# Altium schematic sheet SC941C_STORRM1.SchDoc: Sorties TOR Relais Monostable 1/2
size 393 x 270 mm; CompanyName: Seccom; Address1: 521, rue du capt. François Garbit; Address2: 69440 Mornant; Address3: seccom@seccom.fr; Address4: www.seccom.fr; DocumentNumber: 5; SheetNumber: 5; SheetTotal: 9; PageSetup: Record=PageOptions|CenterHorizontal=True|CenterVertical=True|PrintScale=0.74|XCorrection=1.00|YCorrection=1.00|PrintKind=0|BorderSize=5000000|LeftOffset=0|BottomOffset=0|Orientation=2|PaperLength=1000|PaperWidth=1000|Scale=100|PaperSource=7|PrintQuality=-4|MediaType=1|DitherType=10|PaperKind=A4|PrintScaleMode=1
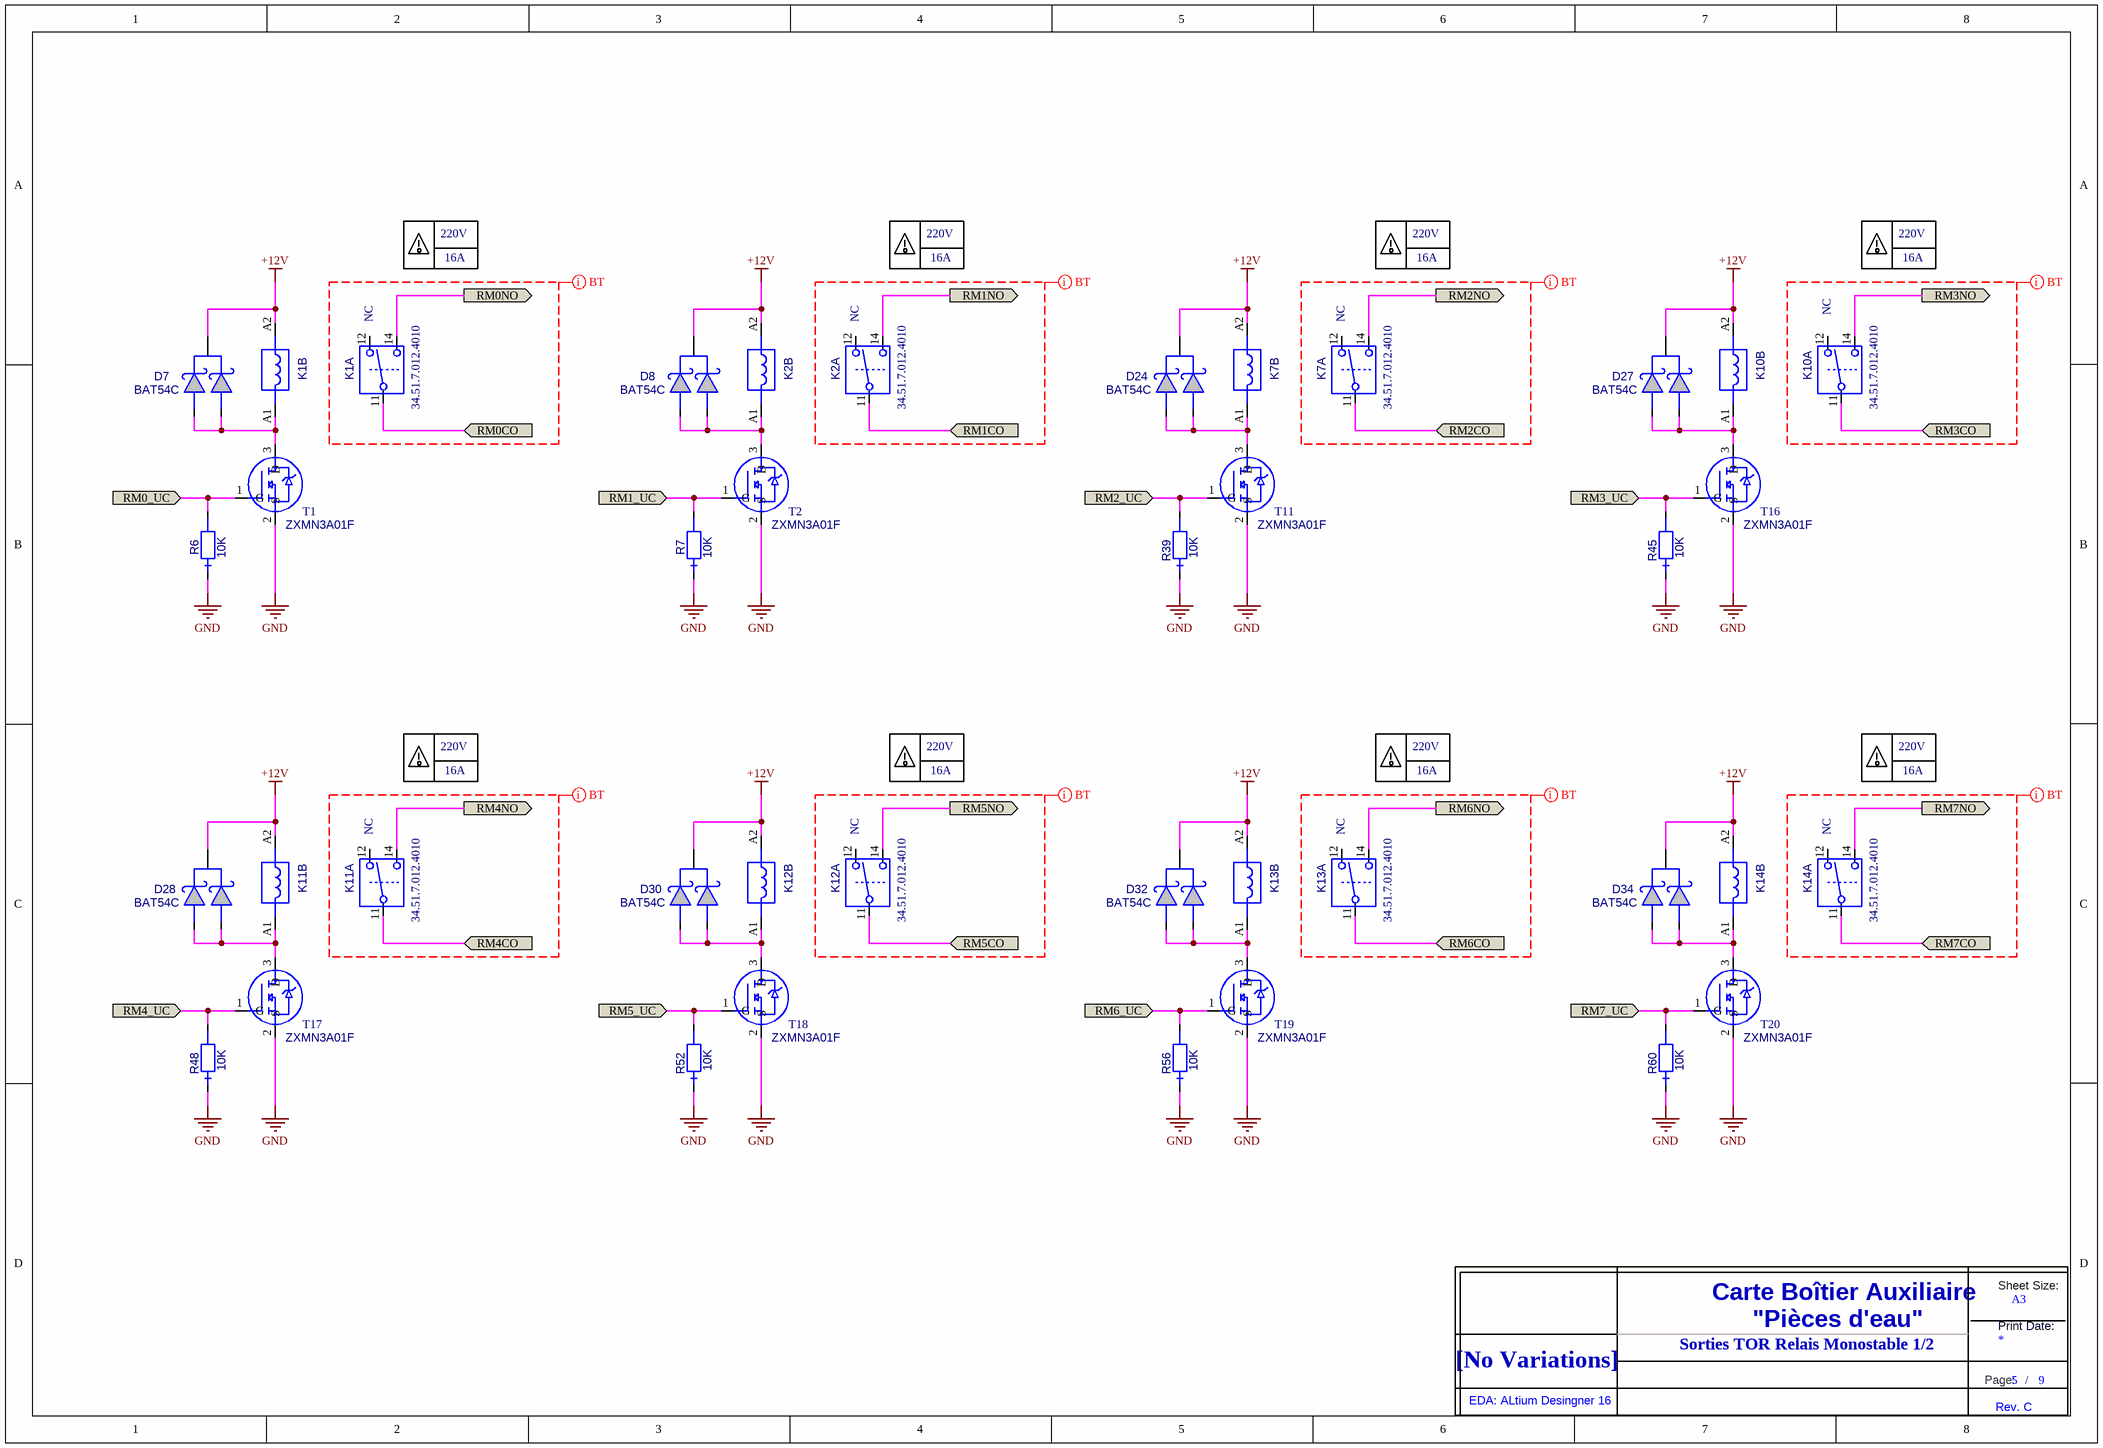
[diagram p0: SC941C_STORRM1.SchDoc]

## Parts
D7  BAT54C  [SOT23_3L_ReflowSoldering]
D8  BAT54C  [SOT23_3L_ReflowSoldering]
D24  BAT54C  [SOT23_3L_ReflowSoldering]
D27  BAT54C  [SOT23_3L_ReflowSoldering]
D28  BAT54C  [SOT23_3L_ReflowSoldering]
D30  BAT54C  [SOT23_3L_ReflowSoldering]
D32  BAT54C  [SOT23_3L_ReflowSoldering]
D34  BAT54C  [SOT23_3L_ReflowSoldering]
K1  RELAY_12VDC_1RT_34.51  [RELAY_FINDER_34.51_+SUPPORT_93]  (value not drawn)  (parts A,B of 2)
K2  RELAY_12VDC_1RT_34.51  [RELAY_FINDER_34.51_+SUPPORT_93]  (value not drawn)  (parts A,B of 2)
K7  RELAY_12VDC_1RT_34.51  [RELAY_FINDER_34.51_+SUPPORT_93]  (value not drawn)  (parts A,B of 2)
K10  RELAY_12VDC_1RT_34.51  [RELAY_FINDER_34.51_+SUPPORT_93]  (value not drawn)  (parts A,B of 2)
K11  RELAY_12VDC_1RT_34.51  [RELAY_FINDER_34.51_+SUPPORT_93]  (value not drawn)  (parts A,B of 2)
K12  RELAY_12VDC_1RT_34.51  [RELAY_FINDER_34.51_+SUPPORT_93]  (value not drawn)  (parts A,B of 2)
K13  RELAY_12VDC_1RT_34.51  [RELAY_FINDER_34.51_+SUPPORT_93]  (value not drawn)  (parts A,B of 2)
K14  RELAY_12VDC_1RT_34.51  [RELAY_FINDER_34.51_+SUPPORT_93]  (value not drawn)  (parts A,B of 2)
R6  value 10K  [0805_ReflowSoldering_RES]  (hidden comment: RES_0805_1%_100PPM_10K)
R7  value 10K  [0805_ReflowSoldering_RES]  (hidden comment: RES_0805_1%_100PPM_10K)
R39  value 10K  [0805_ReflowSoldering_RES]  (hidden comment: RES_0805_1%_100PPM_10K)
R45  value 10K  [0805_ReflowSoldering_RES]  (hidden comment: RES_0805_1%_100PPM_10K)
R48  value 10K  [0805_ReflowSoldering_RES]  (hidden comment: RES_0805_1%_100PPM_10K)
R52  value 10K  [0805_ReflowSoldering_RES]  (hidden comment: RES_0805_1%_100PPM_10K)
R56  value 10K  [0805_ReflowSoldering_RES]  (hidden comment: RES_0805_1%_100PPM_10K)
R60  value 10K  [0805_ReflowSoldering_RES]  (hidden comment: RES_0805_1%_100PPM_10K)
T1  ZXMN3A01F  [SOT23_3L_ReflowSoldering]
T2  ZXMN3A01F  [SOT23_3L_ReflowSoldering]
T11  ZXMN3A01F  [SOT23_3L_ReflowSoldering]
T16  ZXMN3A01F  [SOT23_3L_ReflowSoldering]
T17  ZXMN3A01F  [SOT23_3L_ReflowSoldering]
T18  ZXMN3A01F  [SOT23_3L_ReflowSoldering]
T19  ZXMN3A01F  [SOT23_3L_ReflowSoldering]
T20  ZXMN3A01F  [SOT23_3L_ReflowSoldering]
Title_new  DNI  (value not drawn)  (graphical)

## Ports
RM0_UC (in), RM0CO (in), RM0NO (out), RM1_UC (in), RM1CO (in), RM1NO (out), RM2_UC (in), RM2CO (in), RM2NO (out), RM3_UC (in), RM3CO (in), RM3NO (out), RM4_UC (in), RM4CO (in), RM4NO (out), RM5_UC (in), RM5CO (in), RM5NO (out), RM6_UC (in), RM6CO (in), RM6NO (out), RM7_UC (in), RM7CO (in), RM7NO (out)

## Nets
+12V: D7.3 D8.3 D24.3 D27.3 D28.3 D30.3 D32.3 D34.3 K1.A2 K2.A2 K7.A2 K10.A2 K11.A2 K12.A2 K13.A2 K14.A2
GND: R6.1 R7.1 R39.1 R45.1 R48.1 R52.1 R56.1 R60.1 T1.2(S) T2.2(S) T11.2(S) T16.2(S) T17.2(S) T18.2(S) T19.2(S) T20.2(S)
RM0_UC: R6.2 T1.1(G) ; port RM0_UC
RM0CO: K1.11(COM) ; port RM0CO
RM0NO: K1.14(NO) ; port RM0NO
RM1_UC: R7.2 T2.1(G) ; port RM1_UC
RM1CO: K2.11(COM) ; port RM1CO
RM1NO: K2.14(NO) ; port RM1NO
RM2_UC: R39.2 T11.1(G) ; port RM2_UC
RM2CO: K7.11(COM) ; port RM2CO
RM2NO: K7.14(NO) ; port RM2NO
RM3_UC: R45.2 T16.1(G) ; port RM3_UC
RM3CO: K10.11(COM) ; port RM3CO
RM3NO: K10.14(NO) ; port RM3NO
RM4_UC: R48.2 T17.1(G) ; port RM4_UC
RM4CO: K11.11(COM) ; port RM4CO
RM4NO: K11.14(NO) ; port RM4NO
RM5_UC: R52.2 T18.1(G) ; port RM5_UC
RM5CO: K12.11(COM) ; port RM5CO
RM5NO: K12.14(NO) ; port RM5NO
RM6_UC: R56.2 T19.1(G) ; port RM6_UC
RM6CO: K13.11(COM) ; port RM6CO
RM6NO: K13.14(NO) ; port RM6NO
RM7_UC: R60.2 T20.1(G) ; port RM7_UC
RM7CO: K14.11(COM) ; port RM7CO
RM7NO: K14.14(NO) ; port RM7NO
NetD7_1: D7.1 D7.2 K1.A1 T1.3(D)
NetD8_1: D8.1 D8.2 K2.A1 T2.3(D)
NetD24_1: D24.1 D24.2 K7.A1 T11.3(D)
NetD27_1: D27.1 D27.2 K10.A1 T16.3(D)
NetD28_1: D28.1 D28.2 K11.A1 T17.3(D)
NetD30_1: D30.1 D30.2 K12.A1 T18.3(D)
NetD32_1: D32.1 D32.2 K13.A1 T19.3(D)
NetD34_1: D34.1 D34.2 K14.A1 T20.3(D)

Not connected (* = marked no-connect by the designer): K1 12(NC); K2 12(NC); K7 12(NC); K10 12(NC); K11 12(NC); K12 12(NC); K13 12(NC); K14 12(NC)

## Layout directives
net class BT: (no net found under the mark)

## Notes on the sheet
- 220V
- (near K1) NC
- 16A
- (near K2) NC
- (near K7) NC
- (near K10) NC
- (near K11) NC
- (near K12) NC
- (near K13) NC
- (near K14) NC
- Sorties TOR Relais Monostable 1/2
- (in symbol Title_new) Sheet Size:; Carte Boîtier Auxiliaire; A3; "Pièces d'eau"; Print Date:; [No Variations]; Page:; /; EDA: ALtium Desingner 16; Rev. C

## Library data of the parts
D7 D8 D24 D27 D28 D30 D32 D34 = BAT54C: Diode Schottky double, BAT54 cathode com, Vrrm=30V, If=300mA, Vf=0.4Vmax, CMS; Creation: LJ (14/05/02); Reference: 000597/00; Boitier: SOT23_3L; Remarque: {Remarque}; Fabricant: NXP; Coeff: 1; Verification: LJ (14/05/02); Ref Fab: BAT54C; ComponentLink1URL: o:\_Documentation\Datasheets\NXP\BAT54_series.pdf; ComponentLink2URL: o:\_Documentation\Datasheets\_BOITIERS\ACTIF_CMS\SOT\SOT_23_3P_(Schneider).PDF; Config: *; ComponentLink1Description: Datasheet; ComponentLink2Description: Datasheet Boitier; Value: BAT54C; Supplier 1: Farnell; Supplier Part Number 1: 1081192
K1 K2 K7 K10-K14 = RELAY_12VDC_1RT_34.51: Relais 1RT, 12Vdc, série 34.51, Rc=1940R, Sw:250Vac/6A, Ron=? (AgSnO2); Creation: CHD; Verification: LJ (24/11/11); Boitier: DIP12 Form C; Remarque: {Remarque}; Fabricant: Finder; Ref Fab: 34.51.7.012.4010; Coeff: 1; Value: 34.51.7.012.4010; ComponentLink1URL: o:\_Documentation\Datasheets\Finder\Relais_Serie_34.pdf; ComponentLink2URL: o:\_Documentation\Datasheets\_BOITIERS\; Config: *; ComponentLink1Description: Datasheet; ComponentLink2Description: Datasheet Boitier
R6 R7 R39 R45 R48 R52 R56 R60 = RES_0805_1%_100PPM_10K: Résistance CMS 0805, 0.125W, 1%, 100ppm, 150V; Creation: LJ (06/02/09); Reference: 000063/00; Boitier: 0805; Remarque: {Remarque}; Fabricant: Yageo; Ref Fab: RC0805FR-0710KL; Coeff: 1; Verification: *; ComponentLink1URL: o:\_Documentation\Datasheets\BC_Components\Resistances_ThickFilmFlatChip_0402-0603-0805-1206.pdf; ComponentLink2URL: o:\_Documentation\Datasheets\_BOITIERS\PASSIF_CMS\RC_0805_(2x1,25)_(Schneider).PDF; Config: *; ComponentLink1Description: Datasheet; ComponentLink2Description: Datasheet Boitier; Supplier 1: Farnell; Supplier Part Number 1: 9237755
T1 T2 T11 T16-T20 = ZXMN3A01F: Transistor MOSN logique, Vdss=30V, Id=2A, Rdson=0.12R, CMS; Boitier: SOT23_3L; Remarque: {Remarque}; Creation: CHD; Fabricant: Zetex; Coeff: 1; Ref Fab: ZXMN3A01F; ComponentLink1URL: o:\_Documentation\Datasheets\; ComponentLink2URL: o:\_Documentation\Datasheets\_BOITIERS\ACTIF_CMS\SOT\SOT_23_3P_(Schneider).PDF; Config: *; ComponentLink1Description: Datasheet; Value: ZXMN3A01F; Supplier 1: Farnell; Supplier 2: Mouser; Supplier Part Number 1: 9525734; Supplier Part Number 2: 522-ZXMN3A01FTA
Title_new = Title_new